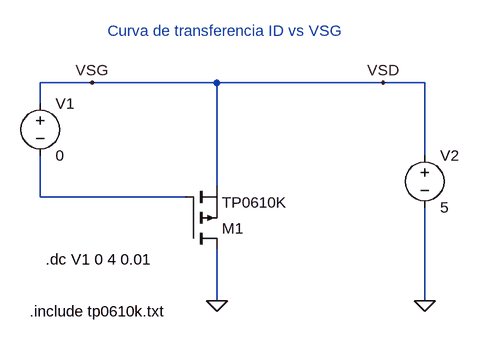
[diagram p0: schematic sim_pmos_transferencia.asc]
sim_pmos_transferencia.asc, the LTspice schematic file:
Version 4
SHEET 1 880 680
WIRE 176 64 96 64
WIRE 368 64 176 64
WIRE 624 64 368 64
WIRE 688 64 624 64
WIRE 96 96 96 64
WIRE 688 176 688 64
WIRE 368 224 368 64
WIRE 96 240 96 176
WIRE 320 240 96 240
WIRE 368 400 368 320
WIRE 688 400 688 256
FLAG 368 400 0
FLAG 688 400 0
FLAG 176 64 VSG
FLAG 624 64 VSD
SYMBOL voltage 96 80 R0
SYMATTR InstName V1
SYMATTR Value 0
SYMATTR Value2 AC 10
SYMBOL pmos 320 320 M180
SYMATTR InstName M1
SYMATTR Value TP0610K
SYMATTR Prefix X
SYMBOL voltage 688 160 R0
SYMATTR InstName V2
SYMATTR Value 5
TEXT 104 336 Left 2 !.dc V1 0 4 0.01
TEXT 80 416 Left 2 !.include tp0610k.txt
TEXT 200 -16 Left 2 ;Curva de transferencia ID vs VSG

The netlist it stands for:
* sim_pmos_transferencia.asc
V1 VSD N001 0 AC 10
XM1 0 N001 VSD TP0610K  ; pins D G S
V2 VSD 0 5
.dc V1 0 4 0.01
.include tp0610k.txt
* Curva de transferencia ID vs VSG
.backanno
.end